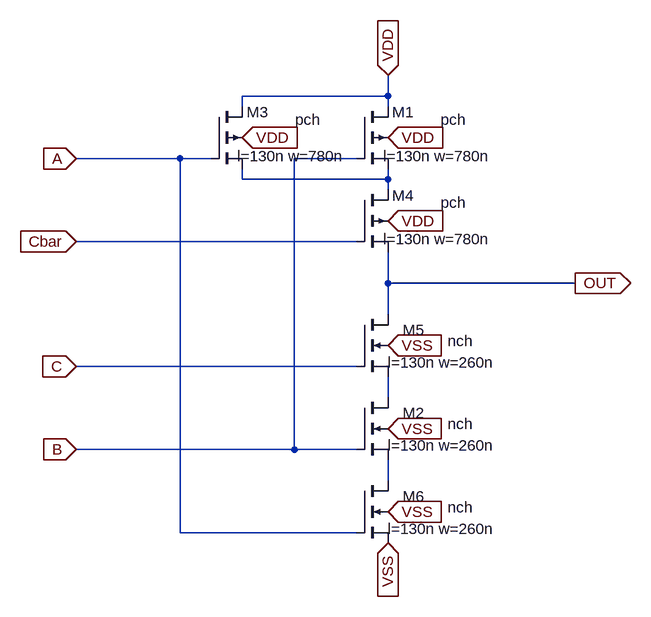
[diagram p0: schematic Nand23state.asc]
Nand23state.asc, the LTspice schematic file:
Version 4.1
SHEET 1 880 792
WIRE 240 0 240 -32
WIRE 240 0 16 0
WIRE 16 16 16 0
WIRE 240 16 240 0
WIRE -80 96 -240 96
WIRE -32 96 -80 96
WIRE 192 96 96 96
WIRE 16 128 16 112
WIRE 240 128 240 112
WIRE 240 128 16 128
WIRE 240 144 240 128
WIRE 192 224 -240 224
WIRE 240 288 240 240
WIRE 528 288 240 288
WIRE 240 336 240 288
WIRE 192 416 -240 416
WIRE 240 464 240 432
WIRE 96 544 96 96
WIRE 96 544 -240 544
WIRE 192 544 96 544
WIRE 240 592 240 560
WIRE -80 672 -80 96
WIRE 192 672 -80 672
FLAG 240 688 VSS
IOPIN 240 688 In
FLAG 240 640 VSS
IOPIN 240 640 In
FLAG 240 512 VSS
IOPIN 240 512 In
FLAG 240 384 VSS
IOPIN 240 384 In
FLAG 240 -32 VDD
IOPIN 240 -32 In
FLAG 16 64 VDD
IOPIN 16 64 In
FLAG 240 64 VDD
IOPIN 240 64 In
FLAG 240 192 VDD
IOPIN 240 192 In
FLAG -240 416 C
IOPIN -240 416 In
FLAG -240 224 Cbar
IOPIN -240 224 In
FLAG -240 96 A
IOPIN -240 96 In
FLAG -240 544 B
IOPIN -240 544 In
FLAG 528 288 OUT
IOPIN 528 288 Out
SYMBOL pmos4 192 16 R0
WINDOW 0 88 9 Right 2
WINDOW 3 168 20 Right 2
WINDOW 123 206 76 Right 2
SYMATTR InstName M1
SYMATTR Value pch
SYMATTR Value2 l=130n w=780n
SYMBOL nmos4 192 464 R0
WINDOW 0 104 24 Right 2
WINDOW 3 179 41 Right 2
WINDOW 123 213 74 Right 2
SYMATTR InstName M2
SYMATTR Value nch
SYMATTR Value2 l=130n w=260n
SYMBOL pmos4 -32 16 R0
WINDOW 0 88 9 Right 2
WINDOW 3 168 20 Right 2
WINDOW 123 206 76 Right 2
SYMATTR InstName M3
SYMATTR Value pch
SYMATTR Value2 l=130n w=780n
SYMBOL pmos4 192 144 R0
WINDOW 0 88 9 Right 2
WINDOW 3 168 20 Right 2
WINDOW 123 206 76 Right 2
SYMATTR InstName M4
SYMATTR Value pch
SYMATTR Value2 l=130n w=780n
SYMBOL nmos4 192 336 R0
WINDOW 0 104 24 Right 2
WINDOW 3 179 41 Right 2
WINDOW 123 213 74 Right 2
SYMATTR InstName M5
SYMATTR Value nch
SYMATTR Value2 l=130n w=260n
SYMBOL nmos4 192 592 R0
WINDOW 0 104 24 Right 2
WINDOW 3 179 41 Right 2
WINDOW 123 213 74 Right 2
SYMATTR InstName M6
SYMATTR Value nch
SYMATTR Value2 l=130n w=260n

The netlist it stands for:
* Nand23state.asc
M1 VDD B N001 VDD pch l=130n w=780n
M2 N002 B N003 VSS nch l=130n w=260n
M3 VDD A N001 VDD pch l=130n w=780n
M4 N001 Cbar OUT VDD pch l=130n w=780n
M5 OUT C N002 VSS nch l=130n w=260n
M6 N003 A VSS VSS nch l=130n w=260n
.model NMOS NMOS
.model PMOS PMOS
.lib standard.mos
.backanno
.end